# Altium schematic sheet FPGA_51_SimpleNetworkProtocol.SchDoc
size A3; Organization: Altium Limited; Address1: L3, 12a Rodborough Rd; Address2: Frenchs Forest; Address3: NSW; Address4: Australia 2086; DocumentNumber: 1; SheetNumber: 1; SheetTotal: 3
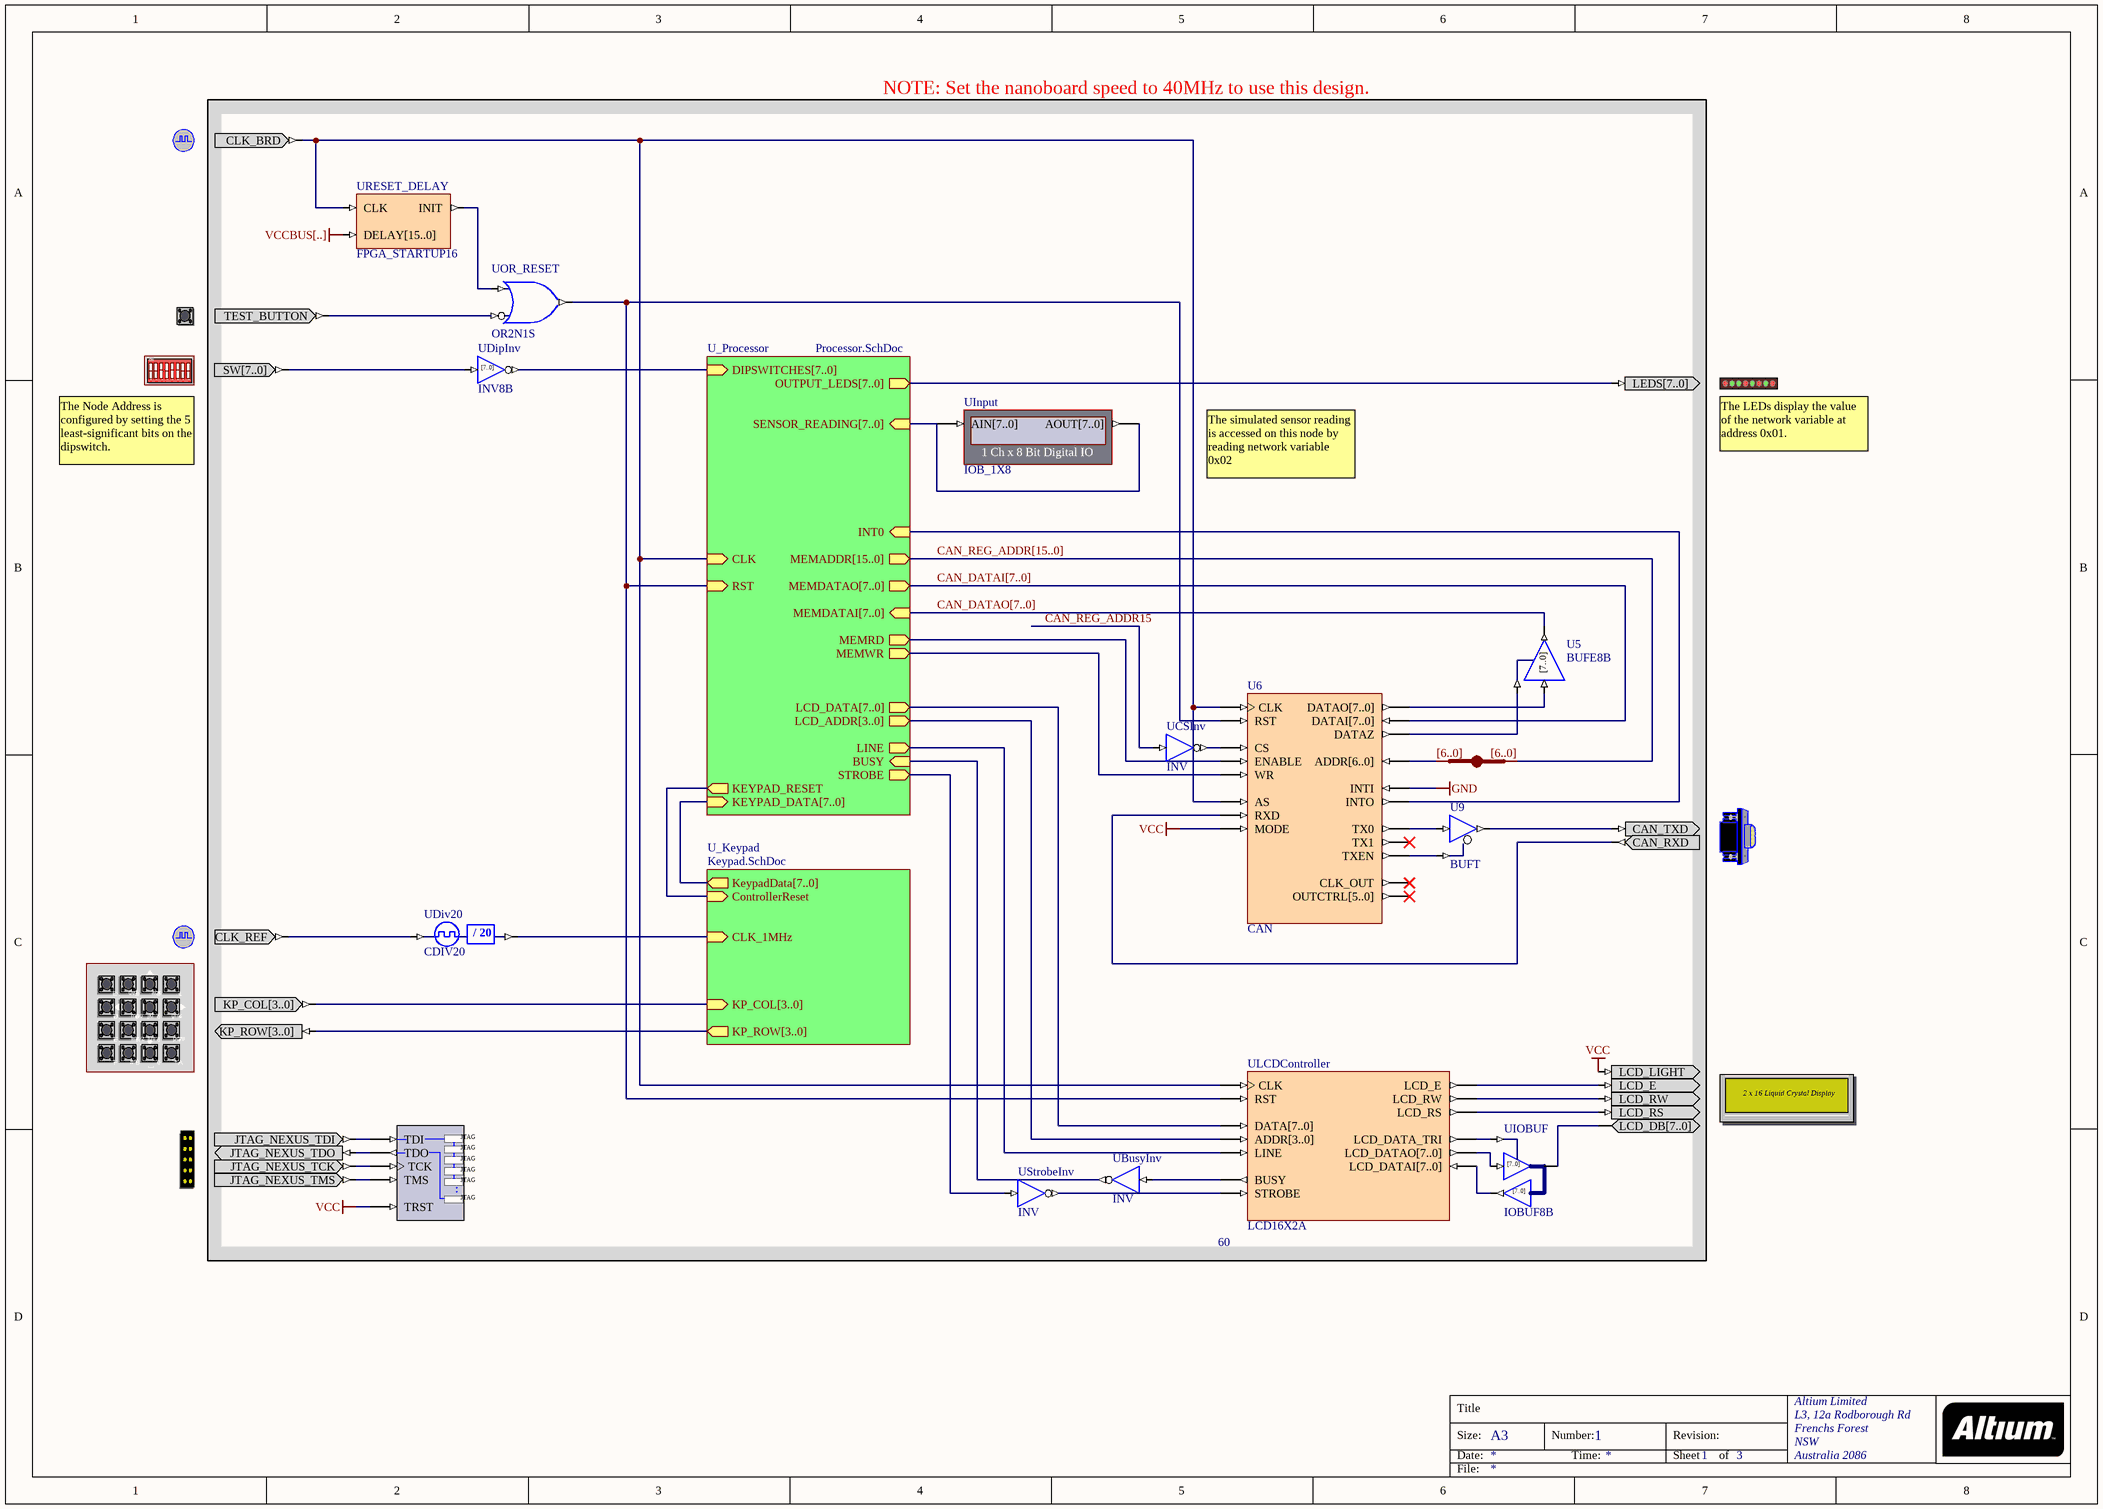
[diagram p0: FPGA_51_SimpleNetworkProtocol.SchDoc]

## Parts
(Parts that share a designator on the sheet are numbered #1, #2 ... from top to bottom, then left to right.)
?#1  CLOCK_BOARD  (value not drawn)
?#2  TEST_BUTTON  (value not drawn)
?#3  DIPSWITCH  (value not drawn)
?#4  LED  (value not drawn)
?#5  CANCNTR  (value not drawn)
?#6  CLOCK_REFERENCE  (value not drawn)
?#7  KEYPAD  (value not drawn)
?#8  LCD  (value not drawn)
?#9  NEXUS_JTAG_CONNECTOR  (value not drawn)
JB_AUTO1  IndexA: [6..0]  (hidden comment: JB)
NEXUS_JTAG_PORT  NEXUS_JTAG_PORT  (value not drawn)
U5  BUFE8B
U6  CAN
U9  BUFT
UBusyInv  INV
UCSInv  INV
UDipInv  INV8B
UDiv20  CDIV20
UInput  IOB_1X8
UIOBUF  IOBUF8B
ULCDController  LCD16X2A  GENERIC_FREQUENCY: 60
UOR_RESET  OR2N1S
URESET_DELAY  FPGA_STARTUP16
UStrobeInv  INV

## Blocks framed on the sheet
NOTE: Set the nanoboard speed to 40MHz to use this design.: ?#1-?#9 JB_AUTO1 NEXUS_JTAG_PORT U5 U6 U9 UBusyInv UCSInv UDipInv UDiv20 UInput UIOBUF ULCDController UOR_RESET URESET_DELAY UStrobeInv

## Sub-sheets
U_Keypad = Keypad.SchDoc: CLK_1MHz (in), ControllerReset (in), KeypadData[7..0] (out), KP_COL[3..0] (in), KP_ROW[3..0] (out)
U_Processor = Processor.SchDoc: CLK (in), RST (in), LCD_DATA[7..0] (out), MEMWR (out), MEMRD (out), MEMADDR[15..0] (out), MEMDATAO[7..0] (out), MEMDATAI[7..0] (in), INT0 (in), BUSY (in), LCD_ADDR[3..0] (out), LINE (out), STROBE (out), DIPSWITCHES[7..0] (in), OUTPUT_LEDS[7..0] (out), SENSOR_READING[7..0] (in), KEYPAD_DATA[7..0] (in), KEYPAD_RESET (out)

## Nets
GND: U6.INTI
VCC: ?#8.LCD_LIGHT NEXUS_JTAG_PORT.TRST U6.MODE
VCCBUS[..]: URESET_DELAY.DELAY[15..0]
CAN_DATAI[7..0]: U6.DATAI[7..0] ; sheet U_Processor/MEMDATAO[7..0]
CAN_DATAO[7..0]: U5.O[7..0] ; sheet U_Processor/MEMDATAI[7..0]
CAN_REG_ADDR15: UCSInv.I
CAN_REG_ADDR[15..0]: JB_AUTO1.B[0..0] ; sheet U_Processor/MEMADDR[15..0]
Net?#1_CLK_BRD: ?#1.CLK_BRD U6.AS U6.CLK ULCDController.CLK URESET_DELAY.CLK ; sheet U_Processor/CLK
Net?#2_TEST_BUTTON: ?#2.TEST_BUTTON UOR_RESET.I0
Net?#3_SW[7..0]: ?#3.SW[7..0] UDipInv.I[7..0]
Net?#4_LEDS[7..0]: ?#4.LEDS[7..0] ; sheet U_Processor/OUTPUT_LEDS[7..0]
Net?#5_CAN_RXD: ?#5.CAN_RXD U6.RXD
Net?#5_CAN_TXD: ?#5.CAN_TXD U9.O(Y)
Net?#6_CLK_REF: ?#6.CLK_REF UDiv20.CLKIN
Net?#7_KP_COL[3..0]: ?#7.KP_COL[3..0] ; sheet U_Keypad/KP_COL[3..0]
Net?#7_KP_ROW[3..0]: ?#7.KP_ROW[3..0] ; sheet U_Keypad/KP_ROW[3..0]
Net?#8_LCD_DB[7..0]: ?#8.LCD_DB[7..0] UIOBUF.IO[7..0]
Net?#8_LCD_E: ?#8.LCD_E ULCDController.LCD_E
Net?#8_LCD_RS: ?#8.LCD_RS ULCDController.LCD_RS
Net?#8_LCD_RW: ?#8.LCD_RW ULCDController.LCD_RW
Net?#9_JTAG_NEXUS_TCK: ?#9.JTAG_NEXUS_TCK NEXUS_JTAG_PORT.TCK
Net?#9_JTAG_NEXUS_TDI: ?#9.JTAG_NEXUS_TDI NEXUS_JTAG_PORT.TDI
Net?#9_JTAG_NEXUS_TDO: ?#9.JTAG_NEXUS_TDO NEXUS_JTAG_PORT.TDO
Net?#9_JTAG_NEXUS_TMS: ?#9.JTAG_NEXUS_TMS NEXUS_JTAG_PORT.TMS
NetJB_AUTO1_A[0..0]: JB_AUTO1.A[0..0] U6.ADDR[6..0]
NetU5_E: U5.E U6.DATAZ
NetU5_I[7..0]: U5.I[7..0] U6.DATAO[7..0]
NetU6_CS: U6.CS UCSInv.O
NetU6_ENABLE: U6.ENABLE ; sheet U_Processor/MEMRD
NetU6_INTO: U6.INTO ; sheet U_Processor/INT0
NetU6_RST: U6.RST ULCDController.RST UOR_RESET.O ; sheet U_Processor/RST
NetU6_TX0: U6.TX0 U9.I
NetU6_TXEN: U6.TXEN U9.T
NetU6_WR: U6.WR ; sheet U_Processor/MEMWR
NetUBusyInv_I: UBusyInv.I ULCDController.BUSY
NetUBusyInv_O: UBusyInv.O ; sheet U_Processor/BUSY
NetUDipInv_O[7..0]: UDipInv.O[7..0] ; sheet U_Processor/DIPSWITCHES[7..0]
NetUDiv20_CLKDV: UDiv20.CLKDV ; sheet U_Keypad/CLK_1MHz
NetUInput_AIN[7..0]: UInput.AIN[7..0] UInput.AOUT[7..0] ; sheet U_Processor/SENSOR_READING[7..0]
NetUIOBUF_I[7..0]: UIOBUF.I[7..0] ULCDController.LCD_DATAO[7..0]
NetUIOBUF_O[7..0]: UIOBUF.O[7..0] ULCDController.LCD_DATAI[7..0]
NetUIOBUF_T: UIOBUF.T ULCDController.LCD_DATA_TRI
NetULCDController_ADDR[3..0]: ULCDController.ADDR[3..0] ; sheet U_Processor/LCD_ADDR[3..0]
NetULCDController_DATA[7..0]: ULCDController.DATA[7..0] ; sheet U_Processor/LCD_DATA[7..0]
NetULCDController_LINE: ULCDController.LINE ; sheet U_Processor/LINE
NetULCDController_STROBE: ULCDController.STROBE UStrobeInv.O
NetUOR_RESET_I1: UOR_RESET.I1 URESET_DELAY.INIT
NetUStrobeInv_I: UStrobeInv.I ; sheet U_Processor/STROBE
(unnamed): sheet U_Processor/KEYPAD_RESET, sheet U_Keypad/ControllerReset

Not connected (* = marked no-connect by the designer): U6 CLK_OUT* OUTCTRL[5..0]* TX1*

## Buses and harness runs
bus CAN_DATAI[7..0] = sheet U_Processor/MEMDATAO[7..0]
bus CAN_DATAO[7..0] = sheet U_Processor/MEMDATAI[7..0]
bus CAN_REG_ADDR[15..0] = sheet U_Processor/MEMADDR[15..0]
bus sheet U_Keypad/KeypadData[7..0] = sheet U_Processor/KEYPAD_DATA[7..0]

## Notes on the sheet
- The LEDs display the value of the network variable at address 0x01.
- The Node Address is configured by setting the 5 least-significant bits on the dipswitch.
- The simulated sensor reading is accessed on this node by reading network variable 0x02
- Title
- Size:
- Date:
- A3
- Number:
- Time:
- Revision:
- Sheet
- of
- File:
- (in symbol BUFE8B) [7..0]
- (in symbol CDIV20) / 20
- (in symbol DIPSWITCH) ON; 1; 2; 3; 4; 5; 6; 7; 8
- (in symbol INV8B) [7..0]
- (in symbol IOBUF8B) [7..0]
- (in symbol KEYPAD) C; def; 3; abc; 2; 1; mno; jkl; ghi; D; 6; 5; 4; E; wxyz; 9; tuv; 8; pqrs; 7; F; #^; B; [; 0; *+; A
- (in symbol LCD) 2 x 16 Liquid Crystal Display
- (in symbol NEXUS_JTAG_PORT) JTAG; .

## Library data of the parts
?#1 = CLOCK_BOARD: Global System Clock Supply; PortComponent: True; Published: 19-Nov-2003; Publisher: Altium Limited
?#2 = TEST_BUTTON: Test Button; PortComponent: True; Published: 19-Nov-2003; Publisher: Altium Limited
?#3 = DIPSWITCH: 8-Way Dip Switch; PortComponent: True; Published: 19-Nov-2003; Publisher: Altium Limited
?#4 = LED: 8-Way LEDS; PortComponent: True; Published: 19-Nov-2003; Publisher: Altium Limited
?#5 = CANCNTR: CAN Bus Connector; PortComponent: True; Published: 19-Nov-2003; Publisher: Altium Limited
?#6 = CLOCK_REFERENCE: Global System Clock Reference Supply; PortComponent: True; Published: 19-Nov-2003; Publisher: Altium Limited
?#7 = KEYPAD: Key Pad; PortComponent: True; Published: 19-Nov-2003; Publisher: Altium Limited
?#8 = LCD: Liquid Crystal Display; PortComponent: True; Published: 19-Nov-2003; Publisher: Altium Limited
?#9 = NEXUS_JTAG_CONNECTOR: JTAG Port; PortComponent: True; Published: 19-Nov-2003; Publisher: Altium Limited
JB_AUTO1 = JB: System BUS Joiner; ArchiveName: GENERIC; Published: 18-Dec-2003; Publisher: Altium Limited; Core Revision: 1.00.00; IndexB: [6..0]
NEXUS_JTAG_PORT = NEXUS_JTAG_PORT: Soft Nexus-Chain Connector; NEXUS_JTAG_CONNECTOR: True; Published: 18-Dec-2003; Publisher: Altium Limited
U5 = BUFE8B: 8-Bit 3-state Buffer with Active High Enable; Xilinx Equivalent: BUFE8; ArchiveName: GENERIC; Published: 18-Sep-2003; Publisher: Altium Limited; Class I: Buffer
U6 = CAN: CAN Controller; ChildModel1: CAN10000_DRAM8X64; Published: 18/12/2003; Publisher: Altium Hobart Technology Centre; Core Revision: 1.00.00
U9 = BUFT: 1-Bit 3-state Buffer with Active Low Enable; ArchiveName: GENERIC; Published: 18-Sep-2003; Publisher: Altium Limited; Class I: Buffer; Xilinx Equivalent: BUFT
UBusyInv UStrobeInv = INV: Inverter; ArchiveName: GENERIC; VHDLIB_SIM: GENERIC_LIB; Published: 28-Jan-2004; Publisher: Altium Limited; Xilinx Equivalent: INV; Core Revision: 1.00.00
UCSInv = INV: Inverter; ArchiveName: GENERIC; Published: 18-Dec-2003; Publisher: Altium Limited; Xilinx Equivalent: INV; Core Revision: 1.00.00
UDipInv = INV8B: 8-Bit Inverter, Bus Version; ArchiveName: GENERIC; Published: 18-Dec-2003; Publisher: Altium Limited; Core Revision: 1.00.00
UDiv20 = CDIV20: Clock Divider by 20; ArchiveName: GENERIC; Published: 18-Dec-2003; Publisher: Altium Limited; Core Revision: 1.00.00
UInput = IOB_1X8: 1 Ch x 8 Bit Digital IO; NEXUS_CORE: Instrument; NEXUS_JTAG_DEVICE: True; NEXUS_JTAG_ORDER: 0; Published: 30/09/2003; Publisher: Altium Hobart Technology Centre; Core Revision: 1.00.00
UIOBUF = IOBUF8B: 8-Bit Input/Output Buffer, Bus Version; ArchiveName: GENERIC; Published: 18-Dec-2003; Publisher: Altium Limited; Core Revision: 1.00.00
ULCDController = LCD16X2A: LCD Controller; Published: 5/01/2004; Publisher: Altium Hobart Technology Centre; Core Revision: 1.00.00
UOR_RESET = OR2N1S: 2-Input OR Gate with Active Low A Input, Single Pin Version; Xilinx Equivalent: OR2B1; ArchiveName: GENERIC; Published: 18-Dec-2003; Publisher: Altium Limited; Core Revision: 1.00.00
URESET_DELAY = FPGA_STARTUP16: FPGA Startup With 16 Bit Delay; Published: 21/01/2004; Publisher: Altium Hobart Technology Centre; Core Revision: 1.00.00